# Altium schematic sheet 2_P2.schdoc
size 307 x 218 mm; Symbol: Drawing-Symbol_A4; Device: Drawing-Symbol_A4; Company: 嘉立创EDA; Version: V1.0; Page Size: A4; @Project Name: TUSB4020BPHP; @Page Count: 2; @Update Date: 2025-04-17; @Create Date: 2025-04-13; @Schematic Name: Schematic1; @Page No: 2; @Page Name: P2; @Create Time: 01:15:57; @Update Time: 21:07:25; Width: 1170; Height: 825; Region Start: 1; X Region Count: 6; Y Region Count: 4; Blade Width: 10; Title Block Position: 3; @Board Name: Board1; SheetNumber: 2; SheetTotal: 3
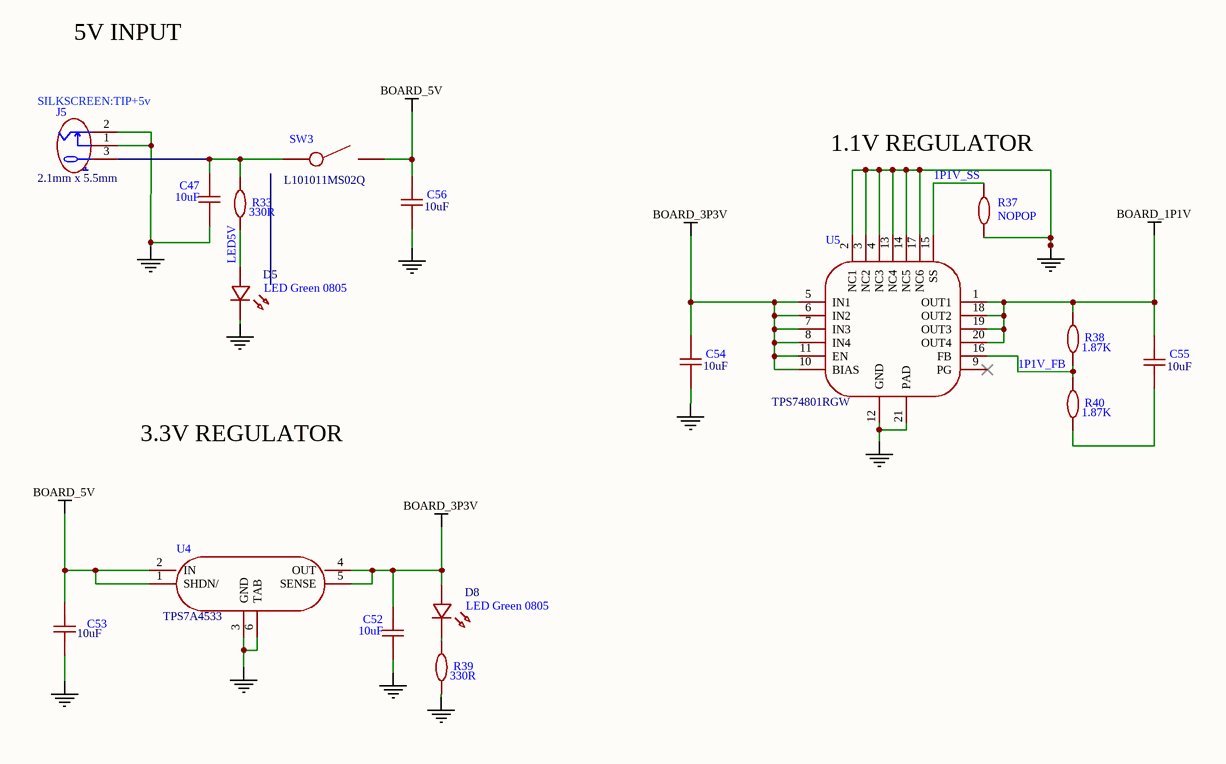
[diagram p0: 2_P2.schdoc]

## Parts
C47  10uF  [C0603]
C52  10uF  [C0603]
C53  10uF  [C0603]
C54  10uF  [C0603]
C55  10uF  [C0603]
C56  10uF  [C0603]
D5  LED Green 0805  [LED_0805]
D8  LED Green 0805  [LED_0805]
J5  (no value)  [J5]
R33  330R  [R0603]
R37  NOPOP  [R0603]
R38  1.87K  [R0603]
R39  330R  [R0603]
R40  1.87K  [R0603]
SW3  (no value)  [SW3]
U4  (no value)  [U4]
U5  (no value)  [U5]

## Nets
BOARD_1P1V: C55.2 R38.2 U5.1(OUT1) U5.18(OUT2) U5.19(OUT3) U5.20(OUT4)
BOARD_3P3V: C52.2 C54.2 D8.2(A) U4.4(OUT) U4.5(SENSE) U5.5(IN1) U5.6(IN2) U5.7(IN3) U5.8(IN4) U5.10(BIAS) U5.11(EN)
BOARD_5V: C53.2 C56.2 SW3.1 U4.1(SHDN/) U4.2(IN)
GND: C47.1 C52.1 C53.1 C54.1 C56.1 D5.1(C) J5.1 J5.2 R37.1 R39.1 U4.3(GND) U4.6(TAB) U5.2(NC1) U5.3(NC2) U5.4(NC3) U5.12(GND) U5.13(NC4) U5.14(NC5) U5.17(NC6) U5.21(PAD)
1P1V_FB: R38.1 R40.2 U5.16(FB)
1P1V_SS: R37.2 U5.15(SS)
LED5V: D5.2(A) R33.1
NetC47_2: C47.2 J5.3 R33.2 SW3.2
NetC55_1: C55.1 R40.1
NetD8_1: D8.1(C) R39.2

Not connected (* = marked no-connect by the designer): U5 9(PG)*

## Notes on the sheet
- 5V INPUT
- (near R37) 1.1V REGULATOR
- 3.3V REGULATOR
- 1
- 2
- 3
- 4
- 5
- 6
- A
- B
- C
- 原理图
- Schematic1
- 创建日期
- 更新日期
- 2025-04-13
- 2025-04-17
- 板子
- 绘制
- Board1
- 图页
- P2
- D
- 审阅
- 版本
- 尺寸
- TUSB4020BPHP
- 页    2    共    2
- V1.0
- A4
- 嘉立创EDA
- (in symbol 2.1mm x 5.5mm) SILKSCREEN:TIP+5v

## Library data of the parts
C47 C52-C56 = CAP_0603: Symbol: CapAcitance; Convert to PCB: yes; Device: CAP_0603; Add into BOM: yes; Supplier Footprint: 0603; Value: 10uF
D5 D8 = LED_0805-G: Symbol: LED_G; Convert to PCB: yes; Device: LED_0805-G; Add into BOM: yes; Supplier Footprint: 0805
J5 = 2.1mm x 5.5mm: Add into BOM: yes; Symbol: 2.1mm x 5.5mm; Device: 2.1mm x 5.5mm; Convert to PCB: yes
R33 R37-R40 = Res_0603: Symbol: 电阻; Convert to PCB: yes; Device: Res_0603; Add into BOM: yes; Supplier Footprint: 0603
  R33 R39: Value: 330R
  R37: Value: NOPOP
  R38 R40: Value: 1.87K
SW3 = L101011MS02Q: Add into BOM: yes; Symbol: L101011MS02Q; Device: L101011MS02Q; Convert to PCB: yes
U4 = TPS7A4533: Add into BOM: yes; Symbol: TPS7A4533; Device: TPS7A4533; Convert to PCB: yes
U5 = TPS74801RGW: Add into BOM: yes; Symbol: TPS74801RGW; Device: TPS74801RGW; Convert to PCB: yes